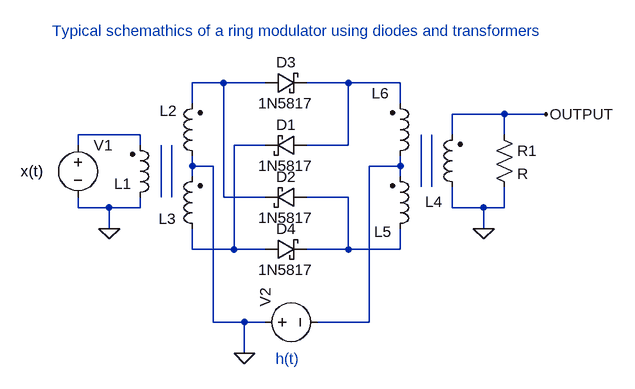
[diagram p0: schematic Draft3.asc]
Draft3.asc, the LTspice schematic file:
Version 4
SHEET 1 880 680
WIRE 256 16 208 16
WIRE 320 16 256 16
WIRE 448 16 384 16
WIRE 528 16 448 16
WIRE 208 48 208 16
WIRE 528 48 528 16
WIRE 688 64 608 64
WIRE 752 64 688 64
WIRE 128 96 32 96
WIRE 608 96 608 64
WIRE 688 96 688 64
WIRE 32 112 32 96
WIRE 128 112 128 96
WIRE 320 112 272 112
WIRE 448 112 448 16
WIRE 448 112 384 112
WIRE 208 144 208 128
WIRE 240 144 208 144
WIRE 528 144 528 128
WIRE 528 144 480 144
WIRE 208 160 208 144
WIRE 528 160 528 144
WIRE 560 176 560 96
WIRE 576 176 576 96
WIRE 160 192 160 112
WIRE 176 192 176 112
WIRE 256 192 256 16
WIRE 320 192 256 192
WIRE 448 192 384 192
WIRE 32 208 32 192
WIRE 80 208 32 208
WIRE 128 208 128 192
WIRE 128 208 80 208
WIRE 608 208 608 176
WIRE 656 208 608 208
WIRE 688 208 688 176
WIRE 688 208 656 208
WIRE 80 240 80 208
WIRE 656 240 656 208
WIRE 208 272 208 240
WIRE 272 272 272 112
WIRE 272 272 208 272
WIRE 320 272 272 272
WIRE 448 272 448 192
WIRE 448 272 384 272
WIRE 528 272 528 240
WIRE 528 272 448 272
WIRE 240 384 240 144
WIRE 288 384 240 384
WIRE 320 384 288 384
WIRE 480 384 480 144
WIRE 480 384 400 384
WIRE 288 432 288 384
FLAG 80 240 0
FLAG 656 240 0
FLAG 752 64 OUTPUT
FLAG 288 432 0
SYMBOL voltage 32 96 R0
WINDOW 123 0 0 Left 0
WINDOW 39 0 0 Left 0
SYMATTR InstName V1
SYMATTR Value ""
SYMBOL ind2 112 208 M180
WINDOW 0 -24 37 Left 2
WINDOW 3 36 40 Left 2
SYMATTR InstName L1
SYMATTR Value ""
SYMATTR Type ind
SYMBOL ind2 224 144 R180
WINDOW 0 39 85 Left 2
WINDOW 3 36 40 Left 2
SYMATTR InstName L2
SYMATTR Value ""
SYMATTR Type ind
SYMBOL ind2 224 256 R180
WINDOW 0 41 31 Left 2
WINDOW 3 36 40 Left 2
SYMATTR InstName L3
SYMATTR Value ""
SYMATTR Type ind
SYMBOL schottky 384 96 R90
WINDOW 0 0 32 VBottom 2
WINDOW 3 32 32 VTop 2
SYMATTR InstName D1
SYMATTR Value 1N5817
SYMATTR Description Diode
SYMATTR Type diode
SYMBOL schottky 320 32 R270
WINDOW 0 32 32 VTop 2
WINDOW 3 0 32 VBottom 2
SYMATTR InstName D3
SYMATTR Value 1N5817
SYMATTR Description Diode
SYMATTR Type diode
SYMBOL schottky 384 176 R90
WINDOW 0 0 32 VBottom 2
WINDOW 3 32 32 VTop 2
SYMATTR InstName D2
SYMATTR Value 1N5817
SYMATTR Description Diode
SYMATTR Type diode
SYMBOL schottky 320 288 R270
WINDOW 0 32 32 VTop 2
WINDOW 3 0 32 VBottom 2
SYMATTR InstName D4
SYMATTR Value 1N5817
SYMATTR Description Diode
SYMATTR Type diode
SYMBOL ind2 624 192 R180
WINDOW 0 31 -7 Left 2
WINDOW 3 36 19 Left 2
SYMATTR InstName L4
SYMATTR Value ""
SYMATTR Type ind
SYMBOL ind2 512 256 M180
WINDOW 0 -24 11 Left 2
WINDOW 3 36 19 Left 2
SYMATTR InstName L5
SYMATTR Value ""
SYMATTR Type ind
SYMBOL ind2 512 144 M180
WINDOW 0 -28 112 Left 2
WINDOW 3 36 19 Left 2
SYMATTR InstName L6
SYMATTR Value ""
SYMATTR Type ind
SYMBOL res 672 80 R0
SYMATTR InstName R1
SYMBOL voltage 304 384 R270
WINDOW 123 0 0 Left 0
WINDOW 39 0 0 Left 0
SYMATTR InstName V2
SYMATTR Value ""
TEXT -56 152 Left 2 !x(t)
TEXT 336 440 Left 2 ;h(t)
TEXT -8 -64 Left 2 ;Typical schemathics of a ring modulator using diodes and transformers

The netlist it stands for:
* Draft3.asc
V1 N003 0
L1 0 N003
L2 0 N001
L3 N004 0
D1 N002 N004 1N5817
D3 N001 N002 1N5817
D2 N010 N001 1N5817
D4 N004 N010 1N5817
L4 0 OUTPUT
L5 N010 N005
L6 N005 N002
R1 OUTPUT 0 R
V2 0 N005
.model D D
.lib standard.dio
x(t)
* h(t)
* Typical schemathics of a ring modulator using diodes and transformers
.backanno
.end